# EAGLE design switchless_icsp_borti (EAGLE 7.0.0)
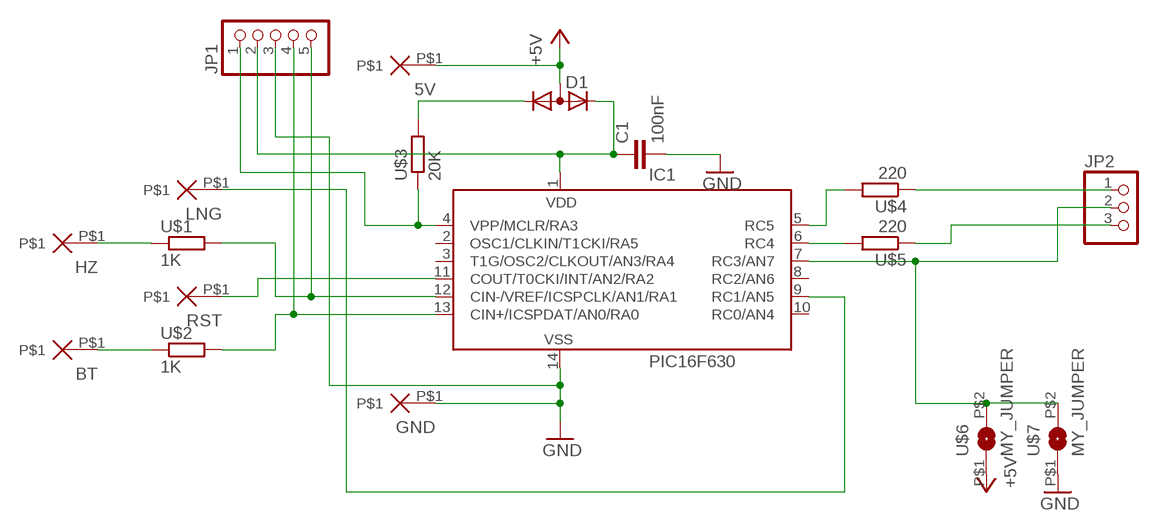
[diagram p0: schematic, sheet 1]

## Parts
5V  PAD  [PADS]
BT  PAD  [PADS]
C1  100nF  C0805  [Z0805]
D1  DIODE_CA-AC__  [SOT23C]
GND  PAD  [PADS]
HZ  PAD  [PADS]
IC1  PIC16F630  [PIC16F630]
JP1  PINHD-1X5  [1X05]
JP2  PINHD-1X3  [1X03]
LNG  PAD  [PADS]
RST  PAD  [PADS]
U$1  1K  R0805  [Z0805]
U$2  1K  R0805  [Z0805]
U$3  20K  R0805  [Z0805]
U$4  220  R0805  [Z0805]
U$5  220  R0805  [Z0805]
U$6  MY_JUMPER  [MYJUMP]
U$7  MY_JUMPER  [MYJUMP]

## Nets
+5V: 5V.P$1 D1.3(A) U$6.P$1
GND: C1.2 GND.P$1 IC1.14(VSS) JP1.3 U$7.P$1
N$1: IC1.5(RC5) U$4.2
N$2: IC1.6(RC4) U$5.2
N$3: JP2.1 U$4.1
N$4: JP2.3 U$5.1
N$5: IC1.9(RC1/AN5) LNG.P$1
N$6: IC1.11(COUT/T0CKI/INT/AN2/RA2) RST.P$1
N$7: IC1.12(CIN-/VREF/ICSPCLK/AN1/RA1) JP1.5 U$1.2
N$8: IC1.13(CIN+/ICSPDAT/AN0/RA0) JP1.4 U$2.2
N$9: IC1.4(VPP/MCLR/RA3) JP1.1 U$3.1
N$10: HZ.P$1 U$1.1
N$11: BT.P$1 U$2.1
N$12: C1.1 D1.2(K2) IC1.1(VDD) JP1.2
N$14: D1.1(K1) U$3.2
N$15: IC1.7(RC3/AN7) JP2.2 U$6.P$2 U$7.P$2
Unconnected: IC1.2(OSC1/CLKIN/T1CKI/RA5) IC1.3(T1G/OSC2/CLKOUT/AN3/RA4) IC1.8(RC2/AN6) IC1.10(RC0/AN4)

## Library data of the parts
5V BT GND HZ LNG RST = snes_div:PAD
C1 = snes_div:C0805
D1 = semicon-smd-ipc:DIODE_CA-AC_: DUAL DIODE
IC1 = snes_div:PIC16F630
JP1 = pinhead:PINHD-1X5: PIN HEADER
JP2 = pinhead:PINHD-1X3: PIN HEADER
U$1-U$5 = snes_div:R0805
U$6 U$7 = snes_div:MY_JUMPER

## Board
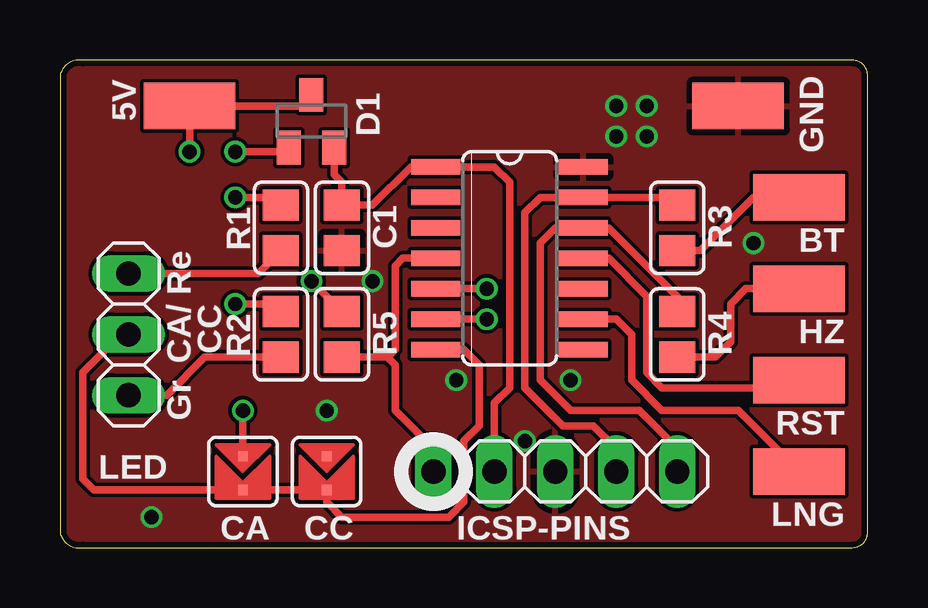
[diagram p1: board, top side]
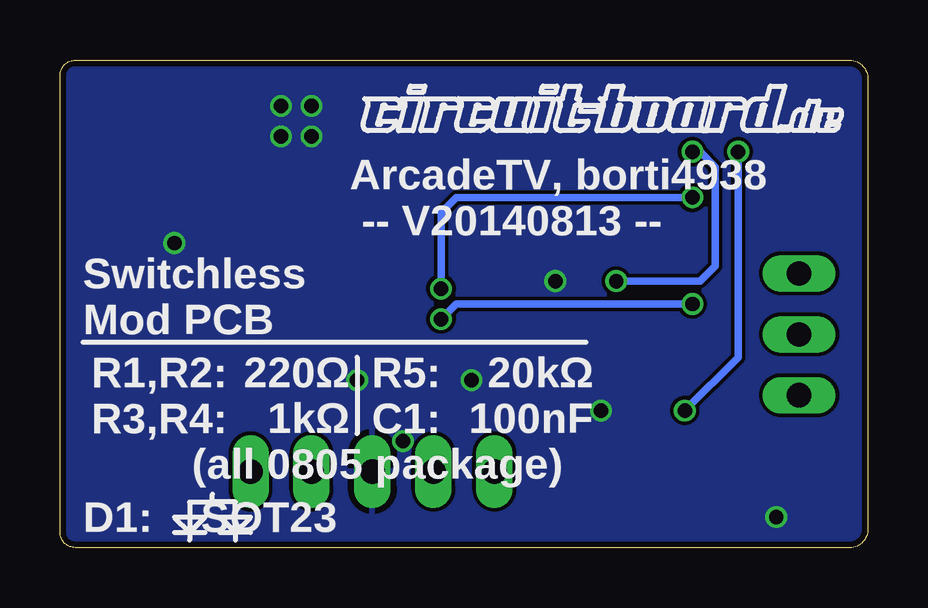
[diagram p2: board, bottom side, seen from below]

Size 33.66 x 20.35 mm. Coordinates in mm from the lower left corner, seen from the top.
Outline: 0,19.7 0,0.65 arc90 0.95,0.02 33.02,0.02 arc90 33.66,0.65 33.66,19.7 arc90 33.02,20.34 0.95,20.34 arc90 0,19.7
Copper layers (1*16): Top 0.035mm / dielectric 1.5mm / Bottom 0.035mm
Design rules "ITEADstudio_DRC": minimum track width 6mil, minimum drill 12mil, track to track 6mil, track to pad 6mil, pad to pad 6mil, via to via 6mil, smd to smd 0mil, copper to edge 10mil, drill to drill 10mil, minimum pad ring 10mil, minimum via ring 6mil, stop-mask expansion 2mil, vias tented up to drill 100mil, thermal gap 10mil

### Footprints (pad centres in the part's own frame; a part is rotated, then mirrored left to right if it is on the bottom)
PADS = smd 1.93 x 3.81: P$1 0,0
Z0805 = smd 1.3 x 1.5: 1 -0.95,0; 2 0.95,0
SOT23C = smd 1 x 1.4: 1 -0.95,-1.1; 2 0.95,-1.1; 3 0,1.1
PIC16F630 = smd 0.66 x 2.032: 1 -3.81,-3.073; 2 -2.54,-3.073; 3 -1.27,-3.073; 4 0,-3.073; 5 1.27,-3.073; 6 2.54,-3.073; 7 3.81,-3.073; 8 3.81,3.073; 9 2.54,3.073; 10 1.27,3.073; 11 0,3.073; 12 -1.27,3.073; 13 -2.54,3.073; 14 -3.81,3.073
1X05 = drill 1.016 long: 1 -5.08,0; 2 -2.54,0; 3 0,0; 4 2.54,0; 5 5.08,0
1X03 = drill 1.016 long: 1 -2.54,0; 2 0,0; 3 2.54,0
MYJUMP = smd 0.406 x 0.406: P$1 -0.635,0; P$2 0.765,0

### Placement (x,y rotation side)
5V  5.4,18.43 270 top
BT  30.8,14.62 90 top
C1  11.75,13.35 270 top
D1  10.48,17.8 0 top
GND  28.26,18.43 90 top
HZ  30.8,10.81 90 top
IC1  18.73,12.08 270 top
JP1  20.64,3.19 0 top
JP2  2.86,8.91 270 top
LNG  30.8,3.19 90 top
RST  30.8,7 90 top
U$1  25.72,8.91 90 top
U$2  25.72,13.35 90 top
U$3  11.75,8.91 90 top
U$4  9.21,13.35 90 top
U$5  9.21,8.91 90 top
U$6  7.62,3.19 270 top
U$7  11.11,3.19 270 top

### Tracks (layer width: path | path; a pad name or v marks a point on that pad's centre or on a via)
+5V  (via drill 0.6)
  Top 0.305: D1.3 10.01,18.43 5V.P$1 v5.4,16.53 | U$6.P$1 v7.62,5.73
  Bottom 0.305: v7.62,5.73 5.4,7.95 v5.4,16.53
GND  (via drill 0.6)
  other vias: 24.45,18.43 23.18,18.43 23.18,17.16 24.45,17.16 13.02,11.13 11.11,5.73 19.37,4.46 3.81,1.29 21.27,7 28.89,12.72 16.51,7
  pour Top: -3.49,23.51 35.88,23.51 35.88,-1.89 -3.49,-1.89
  pour Bottom: -3.49,23.51 -3.49,-1.89 35.88,-1.89 35.88,23.51
N$1  (via drill 0.6)
  Top 0.305: IC1.5 v17.78,10.81 | v7.3,14.62 9.21,14.62 U$4.2
  Bottom 0.305: v17.78,10.81 17.78,13.99 17.15,14.62 v7.3,14.62
N$2  (via drill 0.6)
  Top 0.305: IC1.6 v17.78,9.54 | v7.3,10.18 9.21,10.18 U$5.2
  Bottom 0.305: v17.78,9.54 17.15,10.18 v7.3,10.18
N$3
  Top 0.305: 8.89,12.72 U$4.1 8.25,11.45 JP2.1
N$4
  Top 0.305: U$5.1 6.03,7.96 4.44,6.37 JP2.3
N$5
  Top 0.305: IC1.9 23.18,9.54 23.81,8.91 23.81,7 25.08,5.73 28.26,5.73 LNG.P$1
N$6
  Top 0.305: IC1.11 22.86,12.08 24.45,10.49 24.45,7.32 25.08,6.68 30.48,6.68 RST.P$1
N$7
  Top 0.305: U$1.2 25.72,10.49 22.86,13.35 IC1.12 20.64,13.35 20,12.72 20,7 21.27,5.73 24.13,5.73 25.72,4.14 JP1.5
N$8
  Top 0.305: U$2.2 25.72,14.62 IC1.13 20,14.62 19.37,13.99 19.37,6.68 20.95,5.1 22.23,5.1 23.18,4.14 JP1.4
N$9
  Top 0.305: IC1.4 14.29,12.08 13.97,11.76 13.97,8.27 13.65,7.95 | 13.65,7.95 13.97,7.64 13.97,5.73 15.56,4.14 JP1.1 | U$3.1 13.65,7.96 13.65,7.95
N$10
  Top 0.305: U$1.1 27.31,7.96 27.94,8.59 27.94,10.18 28.58,10.81 HZ.P$1
N$11
  Top 0.305: U$2.1 26.67,12.4 28.89,14.62 BT.P$1
N$12
  Top 0.305: D1.2 11.43,15.57 11.75,15.26 C1.1 13.02,14.3 14.6,15.89 IC1.1 18.1,15.89 18.73,15.26 18.73,6.68 18.1,6.05 JP1.2
N$14  (via drill 0.6)
  Top 0.305: U$3.2 11.43,10.17 v10.48,11.13 | v7.3,16.53 9.36,16.53 D1.1
  Bottom 0.305: v10.48,11.13 6.98,11.13 6.35,11.76 6.35,15.89 6.98,16.53 v7.3,16.53
N$15
  Top 0.305: IC1.7 16.83,8.27 17.46,7.64 17.46,5.1 16.83,4.46 16.83,1.92 16.19,1.29 11.75,1.29 11.11,1.92 U$7.P$2 U$6.P$2 1.4,2.43 0.95,2.87 0.95,7.32 2.54,8.91 JP2.2

### Text on the board
tPlace: CA | CC | ICSP-PINS
tNames: C1 | R3 | Re | R1 | CA/ | CC | R5 | R4 | R2 | Gr | LED
bNames: ArcadeTV, borti4938 / -- V20140813 -- | Switchless / Mod PCB | 20kΩ | R5: / C1: | 220Ω | R1,R2: / R3,R4: | 100nF | 1kΩ | (all 0805 package) | D1: SOT23